# EAGLE design mux_capelet (EAGLE 6.5.0)
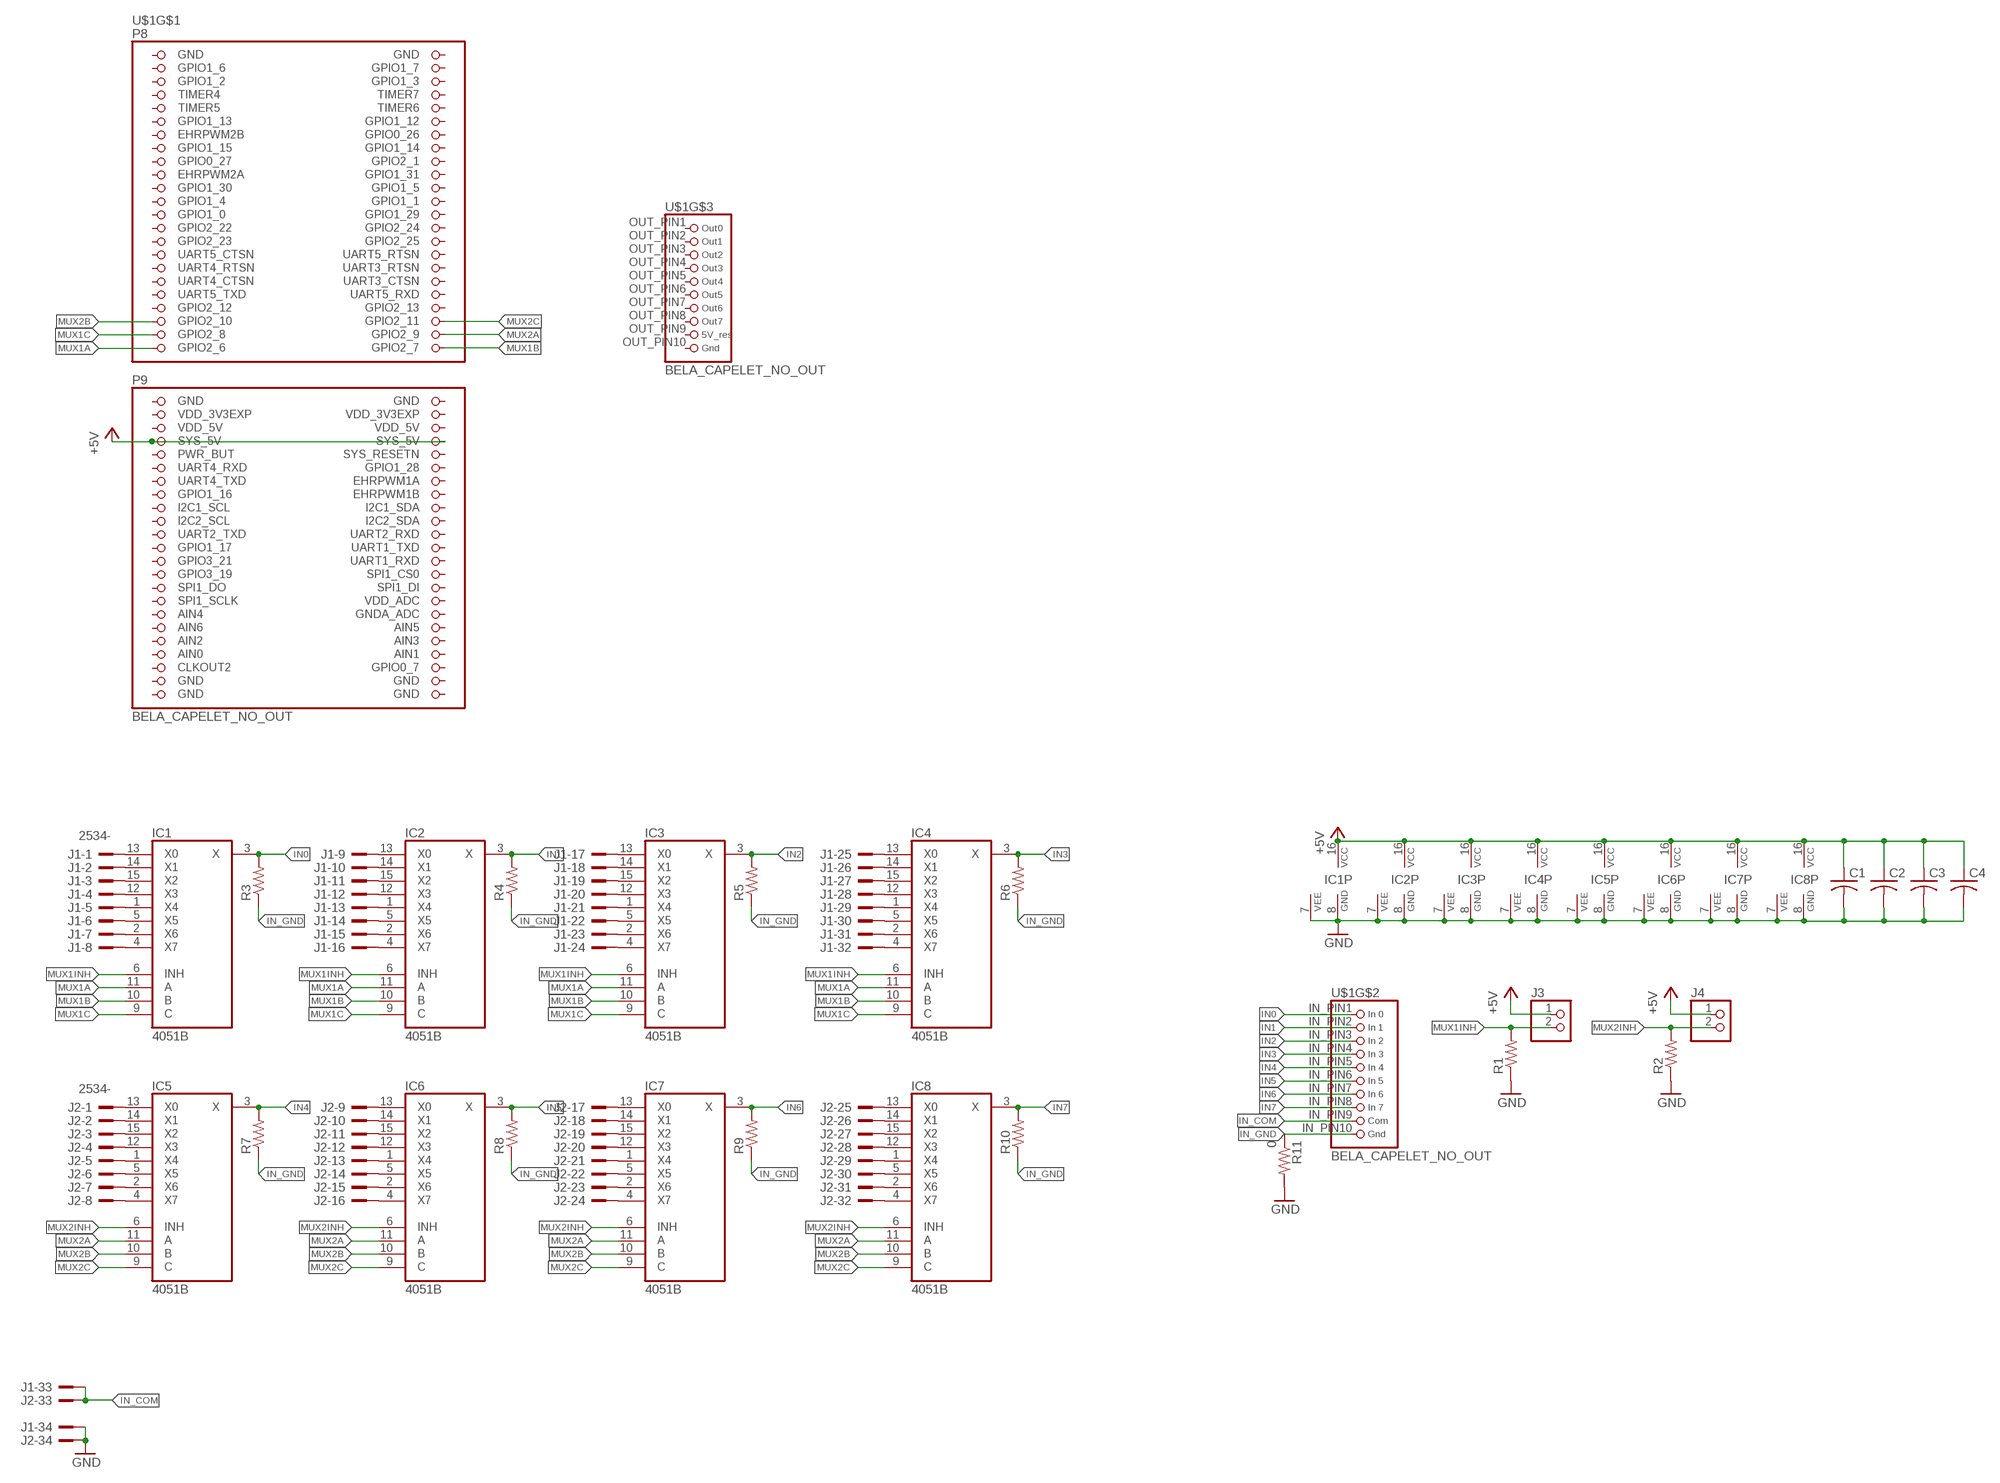
[diagram p0: schematic, sheet 1]

## Parts
C1  C-USC0603  [C0603]
C2  C-USC0603  [C0603]
C3  C-USC0603  [C0603]
C4  C-USC0603  [C0603]
IC1  4051B  [TSSOP16-PW]
IC2  4051B  [TSSOP16-PW]
IC3  4051B  [TSSOP16-PW]
IC4  4051B  [TSSOP16-PW]
IC5  4051B  [TSSOP16-PW]
IC6  4051B  [TSSOP16-PW]
IC7  4051B  [TSSOP16-PW]
IC8  4051B  [TSSOP16-PW]
J1  2534-  [PAK100/2500-34]
J2  2534-  [PAK100/2500-34]
J3  PINHD-1X2  [1X02]
J4  PINHD-1X2  [1X02]
R1  R-US_R0603  [R0603]
R2  R-US_R0603  [R0603]
R3  R-US_R0603  [R0603]
R4  R-US_R0603  [R0603]
R5  R-US_R0603  [R0603]
R6  R-US_R0603  [R0603]
R7  R-US_R0603  [R0603]
R8  R-US_R0603  [R0603]
R9  R-US_R0603  [R0603]
R10  R-US_R0603  [R0603]
R11  0  R-US_R0603  [R0603]
U$1  BELA_CAPELET_NO_OUT  [BELA_CAPELET_NO_OUTLINE]

## Nets
+5V: C1.1 C2.1 C3.1 C4.1 IC1.16(VCC) IC2.16(VCC) IC3.16(VCC) IC4.16(VCC) IC5.16(VCC) IC6.16(VCC) IC7.16(VCC) IC8.16(VCC) J3.1 J4.1 U$1.53(SYS_5V) U$1.54(SYS_5V)
GND: C1.2 C2.2 C3.2 C4.2 IC1.7(VEE) IC1.8(GND) IC2.7(VEE) IC2.8(GND) IC3.7(VEE) IC3.8(GND) IC4.7(VEE) IC4.8(GND) IC5.7(VEE) IC5.8(GND) IC6.7(VEE) IC6.8(GND) IC7.7(VEE) IC7.8(GND) IC8.7(VEE) IC8.8(GND) J1.34 J2.34 R1.1 R2.1 R11.2
IN0: IC1.3(X) R3.2 U$1.IN_PIN1
IN1: IC2.3(X) R4.2 U$1.IN_PIN2
IN2: IC3.3(X) R5.2 U$1.IN_PIN3
IN3: IC4.3(X) R6.2 U$1.IN_PIN4
IN4: IC5.3(X) R7.2 U$1.IN_PIN5
IN5: IC6.3(X) R8.2 U$1.IN_PIN6
IN6: IC7.3(X) R9.2 U$1.IN_PIN7
IN7: IC8.3(X) R10.2 U$1.IN_PIN8
IN_COM: J1.33 J2.33 U$1.IN_PIN9
IN_GND: R3.1 R4.1 R5.1 R6.1 R7.1 R8.1 R9.1 R10.1 R11.1 U$1.IN_PIN10
J2: IC7.15(X2) J2.19
MUX1A: IC1.11(A) IC2.11(A) IC3.11(A) IC4.11(A) U$1.45(GPIO2_6)
MUX1B: IC1.10(B) IC2.10(B) IC3.10(B) IC4.10(B) U$1.46(GPIO2_7)
MUX1C: IC1.9(C) IC2.9(C) IC3.9(C) IC4.9(C) U$1.43(GPIO2_8)
MUX1INH: IC1.6(INH) IC2.6(INH) IC3.6(INH) IC4.6(INH) J3.2 R1.2
MUX2A: IC5.11(A) IC6.11(A) IC7.11(A) IC8.11(A) U$1.44(GPIO2_9)
MUX2B: IC5.10(B) IC6.10(B) IC7.10(B) IC8.10(B) U$1.41(GPIO2_10)
MUX2C: IC5.9(C) IC6.9(C) IC7.9(C) IC8.9(C) U$1.42(GPIO2_11)
MUX2INH: IC5.6(INH) IC6.6(INH) IC7.6(INH) IC8.6(INH) J4.2 R2.2
N$1: IC6.13(X0) J2.9
N$2: IC6.14(X1) J2.10
N$3: IC6.15(X2) J2.11
N$4: IC6.12(X3) J2.12
N$5: IC6.1(X4) J2.13
N$6: IC6.5(X5) J2.14
N$7: IC6.2(X6) J2.15
N$8: IC6.4(X7) J2.16
N$9: IC5.13(X0) J2.1
N$10: IC5.14(X1) J2.2
N$11: IC5.15(X2) J2.3
N$12: IC5.12(X3) J2.4
N$13: IC5.1(X4) J2.5
N$14: IC5.5(X5) J2.6
N$15: IC5.2(X6) J2.7
N$16: IC5.4(X7) J2.8
N$17: IC7.13(X0) J2.17
N$18: IC7.14(X1) J2.18
N$20: IC7.12(X3) J2.20
N$21: IC7.1(X4) J2.21
N$22: IC7.5(X5) J2.22
N$23: IC7.2(X6) J2.23
N$24: IC7.4(X7) J2.24
N$25: IC8.13(X0) J2.25
N$26: IC8.14(X1) J2.26
N$27: IC8.15(X2) J2.27
N$28: IC8.12(X3) J2.28
N$29: IC8.1(X4) J2.29
N$30: IC8.5(X5) J2.30
N$31: IC8.2(X6) J2.31
N$32: IC8.4(X7) J2.32
N$33: IC1.13(X0) J1.1
N$34: IC1.14(X1) J1.2
N$35: IC1.15(X2) J1.3
N$36: IC1.12(X3) J1.4
N$37: IC1.1(X4) J1.5
N$38: IC1.5(X5) J1.6
N$39: IC1.2(X6) J1.7
N$40: IC1.4(X7) J1.8
N$41: IC2.13(X0) J1.9
N$42: IC2.14(X1) J1.10
N$43: IC2.15(X2) J1.11
N$44: IC2.12(X3) J1.12
N$45: IC2.1(X4) J1.13
N$46: IC2.5(X5) J1.14
N$47: IC2.2(X6) J1.15
N$48: IC2.4(X7) J1.16
N$49: IC3.13(X0) J1.17
N$50: IC3.14(X1) J1.18
N$51: IC3.15(X2) J1.19
N$52: IC3.12(X3) J1.20
N$53: IC3.1(X4) J1.21
N$54: IC3.5(X5) J1.22
N$55: IC3.2(X6) J1.23
N$56: IC3.4(X7) J1.24
N$57: IC4.13(X0) J1.25
N$58: IC4.14(X1) J1.26
N$59: IC4.15(X2) J1.27
N$60: IC4.12(X3) J1.28
N$61: IC4.1(X4) J1.29
N$62: IC4.5(X5) J1.30
N$63: IC4.2(X6) J1.31
N$64: IC4.4(X7) J1.32
Unconnected: U$1.3(GPIO1_6) U$1.4(GPIO1_7) U$1.5(GPIO1_2) U$1.6(GPIO1_3) U$1.7(TIMER4) U$1.8(TIMER7) U$1.9(TIMER5) U$1.10(TIMER6) U$1.11(GPIO1_13) U$1.12(GPIO1_12) U$1.13(EHRPWM2B) U$1.14(GPIO0_26) U$1.15(GPIO1_15) U$1.16(GPIO1_14) U$1.17(GPIO0_27) U$1.18(GPIO2_1) U$1.19(EHRPWM2A) U$1.20(GPIO1_31) U$1.21(GPIO1_30) U$1.22(GPIO1_5) U$1.23(GPIO1_4) U$1.24(GPIO1_1) U$1.25(GPIO1_0) U$1.26(GPIO1_29) U$1.27(GPIO2_22) U$1.28(GPIO2_24) U$1.29(GPIO2_23) U$1.30(GPIO2_25) U$1.31(UART5_CTSN) U$1.32(UART5_RTSN) U$1.33(UART4_RTSN) U$1.34(UART3_RTSN) U$1.35(UART4_CTSN) U$1.36(UART3_CTSN) U$1.37(UART5_TXD) U$1.38(UART5_RXD) U$1.39(GPIO2_12) U$1.40(GPIO2_13) U$1.55(PWR_BUT) U$1.56(SYS_RESETN) U$1.57(UART4_RXD) U$1.58(GPIO1_28) U$1.59(UART4_TXD) U$1.60(EHRPWM1A) U$1.61(GPIO1_16) U$1.62(EHRPWM1B) U$1.63(I2C1_SCL) U$1.64(I2C1_SDA) U$1.65(I2C2_SCL) U$1.66(I2C2_SDA) U$1.67(UART2_TXD) U$1.68(UART2_RXD) U$1.69(GPIO1_17) U$1.70(UART1_TXD) U$1.71(GPIO3_21) U$1.72(UART1_RXD) U$1.73(GPIO3_19) U$1.74(SPI1_CS0) U$1.75(SPI1_DO) U$1.76(SPI1_DI) U$1.77(SPI1_SCLK) U$1.78(VDD_ADC) U$1.79(AIN4) U$1.80(GNDA_ADC) U$1.81(AIN6) U$1.82(AIN5) U$1.83(AIN2) U$1.84(AIN3) U$1.86(AIN1) U$1.87(CLKOUT2) U$1.88(GPIO0_7) U$1.OUT_PIN1 U$1.OUT_PIN2 U$1.OUT_PIN3 U$1.OUT_PIN4 U$1.OUT_PIN5 U$1.OUT_PIN6 U$1.OUT_PIN7 U$1.OUT_PIN8 U$1.OUT_PIN9 U$1.OUT_PIN10

## Power pins joined to a net without a drawn wire
AIN0: U$1.85(AIN0)
GND: U$1.1(GND) U$1.2(GND) U$1.47(GND) U$1.48(GND) U$1.89(GND) U$1.90(GND) U$1.91(GND) U$1.92(GND)
VDD_3V3EXP: U$1.49(VDD_3V3EXP) U$1.50(VDD_3V3EXP)
VDD_5V: U$1.51(VDD_5V) U$1.52(VDD_5V)

## Library data of the parts
C1-C4 = resistor:C-US: CAPACITOR, American symbol
IC1-IC8 = custom:4051: 8-channel ANALOG MULTIPLEXER
J1 J2 = con-3m:2534-: 3M (TM) Pak 100 4-Wall Header Source: 3M; OC_FARNELL: unknown; OC_NEWARK: unknown
J3 J4 = pinhead:PINHD-1X2: PIN HEADER
R1-R11 = rcl:R-US_: RESISTOR, American symbol
U$1 = custom:BELA_CAPELET: Should match A3 pinout - but not completely tested

## Board
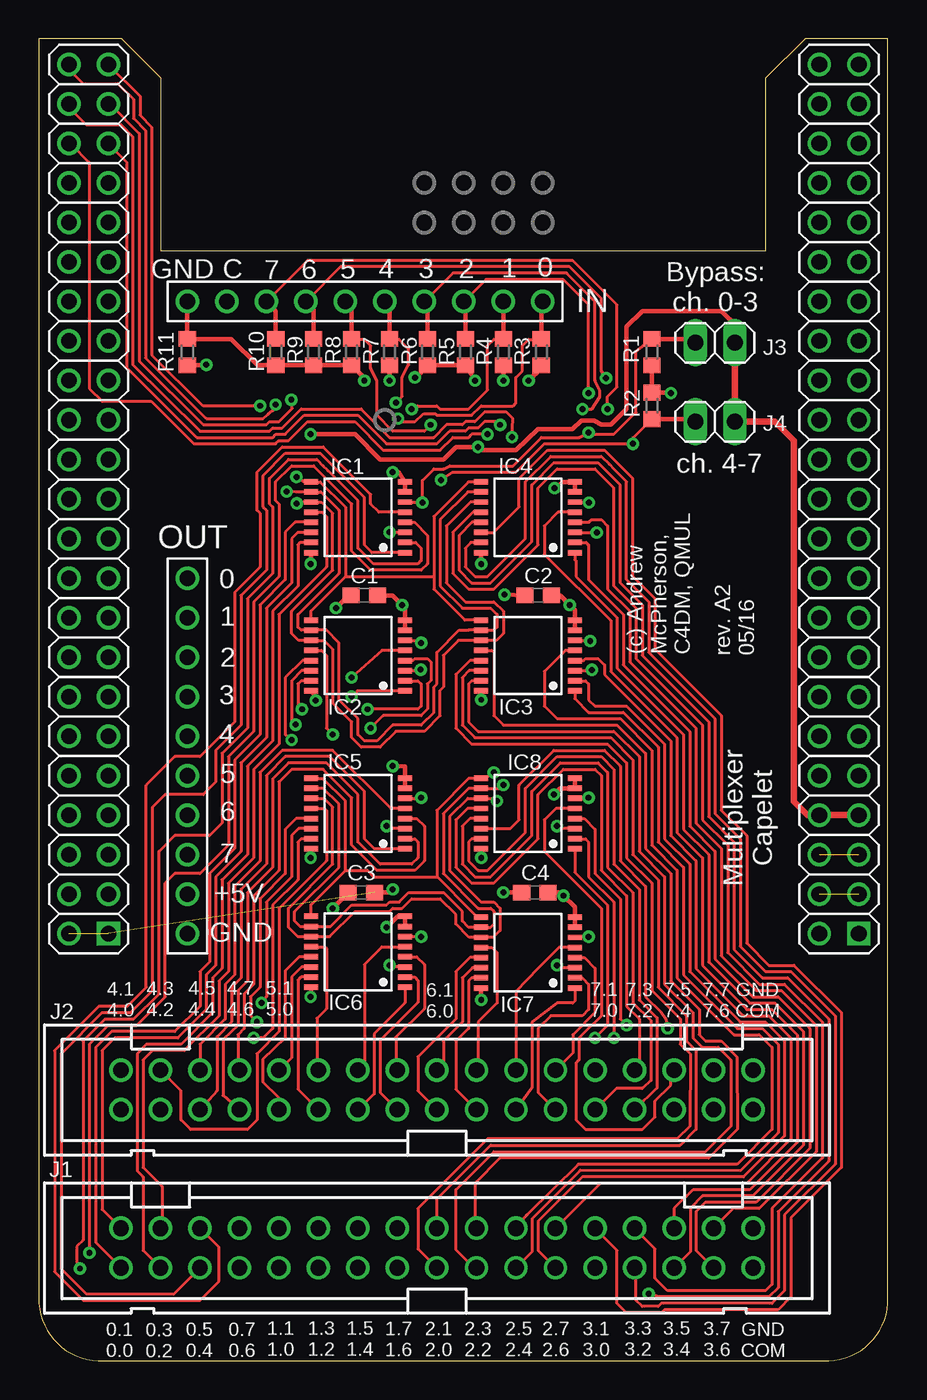
[diagram p1: board, top side]
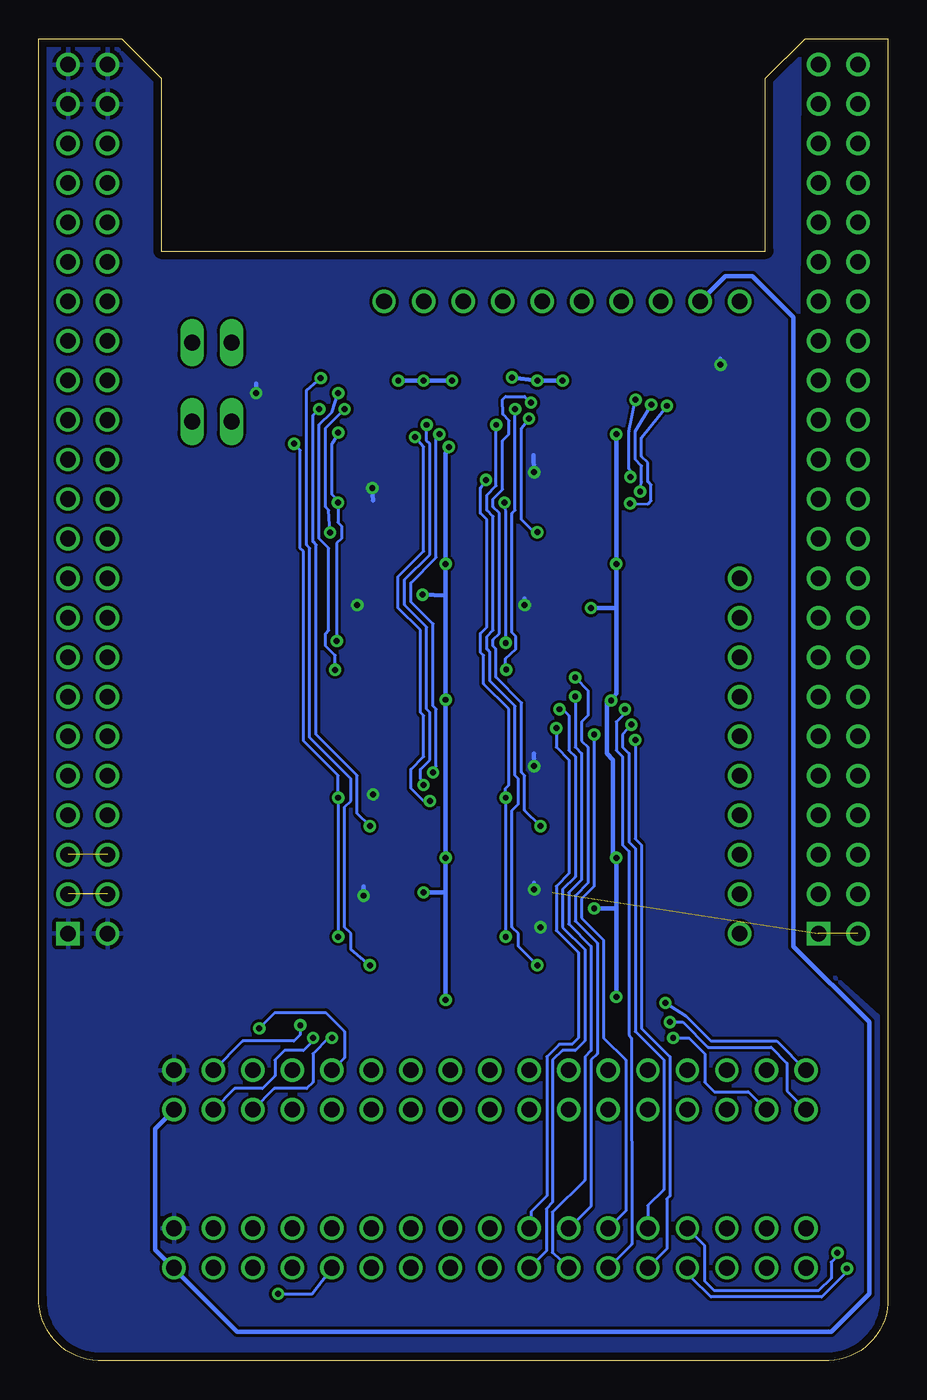
[diagram p2: board, bottom side, seen from below]

Size 54.61 x 84.99 mm. Coordinates in mm from the lower left corner, seen from the top.
Outline: 0,84.99 0,4.04 arc90 3.81,0 50.8,0 arc90 54.61,4.04 54.61,84.99 49.28,84.99 46.74,82.45 46.74,71.35 7.87,71.35 7.87,82.45 5.33,84.99 0,84.99
Copper layers (1*16): Top 0.035mm / dielectric 1.5mm / Bottom 0.035mm
Design rules "default *": minimum track width 7mil, minimum drill 15mil, track to track 7mil, track to pad 7mil, pad to pad 7mil, via to via 7mil, smd to smd 0mil, copper to edge 20mil, drill to drill 8mil, minimum pad ring 10mil, minimum via ring 8mil, stop-mask expansion 4mil, vias tented up to drill 20mil, thermal gap 10mil

### Footprints (pad centres in the part's own frame; a part is rotated, then mirrored left to right if it is on the bottom)
C0603 = smd 1.1 x 1: 1 -0.85,0; 2 0.85,0
TSSOP16-PW = smd 0.35 x 0.9: 1 -2.275,-3.025; 2 -1.625,-3.025; 3 -0.975,-3.025; 4 -0.325,-3.025; 5 0.325,-3.025; 6 0.975,-3.025; 7 1.625,-3.025; 8 2.275,-3.025; 9 2.275,3.025; 10 1.625,3.025; 11 0.975,3.025; 12 0.325,3.025; 13 -0.325,3.025; 14 -0.975,3.025; 15 -1.625,3.025; 16 -2.275,3.025
PAK100/2500-34 = drill 1 pad 1.422: 1 -20.32,-1.27; 2 -20.32,1.27; 3 -17.78,-1.27; 4 -17.78,1.27; 5 -15.24,-1.27; 6 -15.24,1.27; 7 -12.7,-1.27; 8 -12.7,1.27; 9 -10.16,-1.27; 10 -10.16,1.27; 11 -7.62,-1.27; 12 -7.62,1.27; 13 -5.08,-1.27; 14 -5.08,1.27; 15 -2.54,-1.27; 16 -2.54,1.27; 17 0,-1.27; 18 0,1.27; 19 2.54,-1.27; 20 2.54,1.27; 21 5.08,-1.27; 22 5.08,1.27; 23 7.62,-1.27; 24 7.62,1.27; 25 10.16,-1.27; 26 10.16,1.27; 27 12.7,-1.27; 28 12.7,1.27; 29 15.24,-1.27; 30 15.24,1.27; 31 17.78,-1.27; 32 17.78,1.27; 33 20.32,-1.27; 34 20.32,1.27
1X02 = drill 1.016 long: 1 -1.27,0; 2 1.27,0
R0603 = smd 1 x 1.1: 1 -0.85,0; 2 0.85,0
BELA_CAPELET_NO_OUTLINE = drill 1 square: 1 -20.32,-31.75; 47 27.94,-31.75 | drill 1: 2 -22.86,-31.75; 3 -20.32,-29.21; 4 -22.86,-29.21; 5 -20.32,-26.67; 6 -22.86,-26.67; 7 -20.32,-24.13; 8 -22.86,-24.13; 9 -20.32,-21.59; 10 -22.86,-21.59; 11 -20.32,-19.05; 12 -22.86,-19.05; 13 -20.32,-16.51; 14 -22.86,-16.51; 15 -20.32,-13.97; 16 -22.86,-13.97; 17 -20.32,-11.43; 18 -22.86,-11.43; 19 -20.32,-8.89; 20 -22.86,-8.89; 21 -20.32,-6.35; 22 -22.86,-6.35; 23 -20.32,-3.81; 24 -22.86,-3.81; 25 -20.32,-1.27; 26 -22.86,-1.27; 27 -20.32,1.27; 28 -22.86,1.27; 29 -20.32,3.81; 30 -22.86,3.81; 31 -20.32,6.35; 32 -22.86,6.35; 33 -20.32,8.89; 34 -22.86,8.89; 35 -20.32,11.43; 36 -22.86,11.43; 37 -20.32,13.97; 38 -22.86,13.97; 39 -20.32,16.51; 40 -22.86,16.51; 41 -20.32,19.05; 42 -22.86,19.05; 43 -20.32,21.59; 44 -22.86,21.59; 45 -20.32,24.13; 46 -22.86,24.13; 48 25.4,-31.75; 49 27.94,-29.21; 50 25.4,-29.21; 51 27.94,-26.67; 52 25.4,-26.67; 53 27.94,-24.13; 54 25.4,-24.13; 55 27.94,-21.59; 56 25.4,-21.59; 57 27.94,-19.05; 58 25.4,-19.05; 59 27.94,-16.51; 60 25.4,-16.51; 61 27.94,-13.97; 62 25.4,-13.97; 63 27.94,-11.43; 64 25.4,-11.43; 65 27.94,-8.89; 66 25.4,-8.89; 67 27.94,-6.35; 68 25.4,-6.35; 69 27.94,-3.81; 70 25.4,-3.81; 71 27.94,-1.27; 72 25.4,-1.27; 73 27.94,1.27; 74 25.4,1.27; 75 27.94,3.81; 76 25.4,3.81; 77 27.94,6.35; 78 25.4,6.35; 79 27.94,8.89; 80 25.4,8.89; 81 27.94,11.43; 82 25.4,11.43; 83 27.94,13.97; 84 25.4,13.97; 85 27.94,16.51; 86 25.4,16.51; 87 27.94,19.05; 88 25.4,19.05; 89 27.94,21.59; 90 25.4,21.59; 91 27.94,24.13; 92 25.4,24.13; IN_PIN1 7.62,8.89; IN_PIN2 5.08,8.89; IN_PIN3 2.54,8.89; IN_PIN4 0,8.89; IN_PIN5 -2.54,8.89; IN_PIN6 -5.08,8.89; IN_PIN7 -7.62,8.89; IN_PIN8 -10.16,8.89; IN_PIN9 -12.7,8.89; IN_PIN10 -15.24,8.89; OUT_PIN1 -15.24,-8.89; OUT_PIN2 -15.24,-11.43; OUT_PIN3 -15.24,-13.97; OUT_PIN4 -15.24,-16.51; OUT_PIN5 -15.24,-19.05; OUT_PIN6 -15.24,-21.59; OUT_PIN7 -15.24,-24.13; OUT_PIN8 -15.24,-26.67; OUT_PIN9 -15.24,-29.21; OUT_PIN10 -15.24,-31.75

### Placement (x,y rotation side)
C1  20.93,49.2 0 top
C2  32.11,49.2 0 top
C3  20.73,30.1 0 top
C4  31.9,30.1 0 top
IC1  20.52,54.23 90 top
IC2  20.52,45.34 90 top
IC3  31.45,45.34 90 top
IC4  31.45,54.23 90 top
IC5  20.52,35.18 90 top
IC6  20.52,26.29 90 top
IC7  31.45,26.24 90 top
IC8  31.45,35.18 90 top
J1  25.6,7.24 0 top
J2  25.6,17.4 0 top
J3  43.48,65.46 180 top
J4  43.48,60.38 180 top
R1  39.42,64.85 90 top
R2  39.42,61.39 270 top
R3  32.31,64.85 90 top
R4  29.87,64.85 90 top
R5  27.43,64.85 90 top
R6  24.99,64.85 90 top
R7  22.56,64.85 90 top
R8  20.12,64.85 90 top
R9  17.68,64.85 90 top
R10  15.24,64.85 90 top
R11  9.55,64.85 270 top
U$1  24.79,59.21 0 top

### Tracks (layer width: path | path; a pad name or v marks a point on that pad's centre or on a via)
+5V  (via drill 0.38)
  Top 0.305: IC6.16 17.5,23.42 v17.48,23.39 | v17.48,32.33 17.48,32.88 IC5.16 | IC8.16 28.42,32.36 v28.45,32.33 | v28.45,23.19 28.45,23.73 IC7.16 | C4.1 v29.87,30.1 | C3.1 19.88,30.06 v18.9,29.08 | IC3.16 28.42,42.52 v28.45,42.49 | IC2.16 17.91,42.52 v17.8,42.44 | IC1.16 17.5,51.25 v17.48,51.23 | IC4.16 28.42,51.26 v28.45,51.23 | C1.1 19.91,49.2 v19.1,48.39 | C2.1 v29.94,49.25 | J3.1 44.91,65.61 44.91,66.47 43.89,67.49 38.81,67.49 37.8,66.47 37.8,61.19 36.78,60.17 36.17,60.17 35.71,60.45 34.9,60.45 34.33,59.88 32.09,59.88 30.68,58.55 28.45,58.55 v28.25,58.75 26.82,58.75 26.01,57.94 21.95,57.94 20.32,59.56 v17.48,59.56
  Top 0.406: J3.1 J4.1 47.35,60.38 48.56,59.16 48.56,35.94 48.87,35.64 49.17,35.33 49.43,35.08 U$1.54 U$1.53
  Bottom 0.305: v17.48,23.39 17.48,29.08 | 17.48,29.08 v17.48,32.33 17.68,32.54 17.68,38.63 18.09,39.04 18.09,42.29 v17.8,42.44 17.48,42.9 17.48,48.39 | 28.45,30.1 v28.45,32.33 v28.45,42.49 28.45,49.2 | 28.45,30.1 v28.45,23.19 | v29.87,30.1 28.45,30.1 | v18.9,29.08 17.48,29.08 | 17.48,48.39 v17.48,51.23 v17.48,59.56 | 28.45,49.2 v28.45,51.23 28.45,58.34 28.25,58.55 v28.25,58.75 | v19.1,48.39 17.48,48.39 | v29.94,49.25 28.45,49.2
GND  (via drill 0.38)  (2 unrouted)
  Top 0.305: IC6.7 IC6.8 23.05,28.56 v22.35,27.86 | IC5.8 IC5.7 23.55,38.2 v22.76,38.23 | IC8.8 IC8.7 33.53,36.8 v33.12,36.4 | IC7.7 IC7.8 34.47,29.16 v33.73,29.9 33.53,30.1 C4.2 | C3.2 22.76,30.1 v22.76,30.3 | IC2.7 IC2.8 23.55,48.41 v23.37,48.59 22.76,49.2 C1.2 | IC3.7 IC3.8 34.47,48.26 v34.14,48.59 33.53,49.2 C2.2 | IC4.7 IC4.8 33.72,56.5 v33.17,56.11 | IC1.7 IC1.8 23.15,57.11 v22.76,57.12 | R1.1 R2.1 40.47,62.24 v40.64,62.2 | R11.2 10.73,64 v10.77,64.03
  Bottom 0.305: v33.73,29.9 33.73,30.51 | v22.76,30.3 22.76,30.71 | v23.37,48.59 23.37,49 | v33.17,56.11 33.12,55.3 | v22.76,57.12 22.81,58.22 | v34.14,48.59 34.14,48.79 | v22.35,27.86 22.35,27.66 | v22.76,38.23 22.76,39.04 | v33.12,36.4 33.12,36.19 | v40.64,62.2 40.64,62.81 | v10.77,64.03 10.77,64.44
  pour Bottom: 0,0.23 54.55,0.23 54.55,85.09 5.69,84.89 5.89,26.85 0,21.56
IN0  (via drill 0.38)
  Top 0.178: IC1.3 22.36,53.25 v22.55,53.26 | v23.09,60.58 23.3,60.38 24.18,60.38 24.75,60.89 25.5,60.89 25.6,60.78 27.84,60.78 28.45,61.39 30.48,61.39 30.68,61.59 30.68,63.22 31.09,63.63 31.09,65.25 31.5,65.66 32.27,65.66 R3.2
  Top 0.305: R3.2 32.31,68 U$1.IN_PIN1
  Bottom 0.178: v22.55,53.26 22.76,53.26 23.57,54.08 23.57,59.97 v23.09,60.58
IN1  (via drill 0.38)
  Top 0.178: IC2.3 24.43,44.36 v24.55,44.43 | v23.98,61.19 24.18,61.19 24.38,61.39 25.6,61.39 25.81,61.19 27.64,61.19 28.85,62.41 28.85,65.25 29.26,65.66 29.83,65.66 R4.2
  Top 0.305: R4.2 U$1.IN_PIN2
  Bottom 0.178: v24.55,44.43 24.59,45.14 23.93,45.75 23.93,46.56 24.18,46.81 24.18,54.48 23.98,54.69 v23.98,61.19
IN2  (via drill 0.38)
  Top 0.178: IC3.3 35.4,44.36 v35.56,44.42 | v35.36,62.2 35.36,67.89 33.73,69.52 28.75,69.52 U$1.IN_PIN3
  Top 0.305: R5.2 27.43,68 U$1.IN_PIN3
  Bottom 0.178: v35.56,44.42 35.56,45.34 36.17,45.95 36.17,46.76 35.97,46.96 35.97,52.25 36.58,52.86 36.58,60.17 35.76,60.99 v35.36,62.2
IN3  (via drill 0.38)
  Top 0.178: IC4.3 35.96,53.25 v35.88,53.25 | v34.95,61.19 35.56,61.19 36.07,61.97 36.07,62.38 35.76,63.02 35.76,68.1 33.93,69.93 26.62,69.93 U$1.IN_PIN4
  Top 0.305: R6.2 24.99,67.89 U$1.IN_PIN4
  Bottom 0.178: v35.88,53.25 35.97,54.69 36.17,54.89 36.17,59.97 v34.95,61.19
IN4  (via drill 0.38)
  Top 0.178: IC5.3 22.51,34.2 v22.35,34.37 | v22.96,61.59 23.37,62 23.37,63.22 23.77,64.03 23.77,65.05 23.16,65.66 22.59,65.66 R7.2
  Top 0.305: R7.2 22.55,67.79 U$1.IN_PIN5
  Bottom 0.178: v22.35,34.37 23.37,35.38 23.37,37.62 23.57,37.82 23.57,42.29 25.22,43.94 25.22,45.77 25.4,45.95 25.4,46.35 24.99,46.76 24.99,54.48 25.4,54.89 25.4,55.41 24.79,56.02 24.79,59.16 24.38,59.56 24.36,60.44 24.77,60.85 24.79,61.8 24.59,62 23.37,62 v22.96,61.59
IN5  (via drill 0.38)
  Top 0.178: IC6.3 22.67,25.31 v22.55,25.43 | v25.2,60.17 24.79,59.77 22.76,59.77 21.74,60.78 21.74,63.02 21.34,63.83 21.34,65.25 20.93,65.66 20.15,65.66 R8.2
  Top 0.305: R8.2 20.12,67.69 U$1.IN_PIN6
  Bottom 0.178: v22.55,25.43 23.77,26.64 23.77,27.46 24.18,27.86 24.18,35.38 23.77,35.79 23.77,37.41 23.98,37.62 23.98,42.09 25.6,43.71 25.6,45.54 25.81,45.75 25.81,46.56 25.4,46.96 25.4,54.28 25.81,54.69 25.81,55.65 25.2,56.26 v25.2,60.17
IN6  (via drill 0.38)
  Top 0.178: IC7.3 33.49,25.26 v33.33,25.43 | v36.48,63.17 36.17,63.63 36.17,68.3 34.14,70.33 19.41,70.33 U$1.IN_PIN7
  Top 0.305: R9.2 17.68,67.59 U$1.IN_PIN7
  Bottom 0.178: v33.33,25.43 34.54,26.44 34.54,27.46 34.95,27.86 34.95,35.59 34.54,35.99 34.54,37.41 37.19,40.06 37.19,52.25 37.39,52.45 37.39,62.41 v36.48,63.17
IN7  (via drill 0.38)
  Top 0.178: IC8.3 33.49,34.2 v33.33,34.37 | v36.58,61.19 36.58,62 37.19,62.61 37.19,67.89 34.34,70.74 17.27,70.74 U$1.IN_PIN8
  Top 0.305: R10.2 15.24,67.49 U$1.IN_PIN8
  Bottom 0.178: v33.33,34.37 34.14,35.18 34.14,37.62 36.78,40.26 36.78,52.45 36.98,52.65 36.98,60.78 v36.58,61.19
IN_COM
  Bottom 0.305: J2.33 47.14,14.91 47.14,7.14 45.97,5.97 J1.33 45.92,5.92 41.86,1.85 3.66,1.85 1.22,4.29 1.22,21.77 6.1,26.64 6.1,67.08 8.74,69.72 10.46,69.72 U$1.IN_PIN9
IN_GND  (via drill 0.38)
  Top 0.305: U$1.IN_PIN10 R11.1 12.36,65.7 14.06,64 R10.1 R9.1 R8.1 21.1,63.02 v20.93,63.02 | R7.1 v22.55,63.02 | v24.18,63.22 24.99,63.83 R6.1 R5.1 v28.04,63.02 | v29.87,63.02 R4.1 | R3.1 32.31,63.83 v31.5,63.02
  Bottom 0.305: v20.93,63.02 v22.55,63.02 v24.18,63.22 | v28.04,63.02 v29.87,63.02 v31.5,63.02
J2
  Top 0.178: IC7.15 27.84,24.61 27.64,24.41 27.64,21.36 26.82,20.55 26.82,17.45 J2.19
MUX1A  (via drill 0.38)
  Top 0.178: IC4.11 27.75,55.2 26.21,53.67 26.21,50.01 27.43,48.79 29.26,48.79 29.87,48.18 29.87,46.76 29.42,46.31 IC3.11 26.98,46.31 26.01,45.34 26.01,43.31 25.81,43.1 25.81,41.48 24.79,40.46 22.96,40.46 21.95,39.45 20.73,39.45 20.12,40.06 20.12,41.07 18.9,42.29 18.9,45.75 18.33,46.31 IC2.11 16.7,46.31 16.26,46.76 16.26,48.18 18.9,50.83 18.9,54.48 18.18,55.2 IC1.11 16.77,55.2 v16.59,55.12 | U$1.45 6.5,81.31 6.5,80.09 7.26,79.3 7.26,64.67 10.57,61.39 v14.22,61.39
  Bottom 0.178: v16.59,55.12 15.44,55.09 15.24,55.3 15.24,56.31 15.44,56.51 15.44,57.73 15.85,58.14 15.85,59.36 v14.22,61.39
MUX1B  (via drill 0.38)
  Top 0.178: IC4.10 27.58,55.85 25.81,54.08 25.81,49.81 27.23,48.39 29.06,48.39 29.46,47.98 29.46,47.17 29.26,46.96 IC3.10 27.64,46.96 27.63,46.96 27.03,46.96 25.6,45.54 25.6,43.51 25.4,43.31 25.4,41.68 24.59,40.87 22.76,40.87 21.74,39.85 20.93,39.85 20.52,40.26 20.52,41.27 19.3,42.49 19.3,46.15 18.49,46.96 IC2.10 16.87,46.96 16.66,47.17 16.66,47.98 19.3,50.62 19.3,54.69 18.14,55.85 IC1.10 16.51,55.85 v15.94,55.89 | U$1.46 1.93,83.03 2.85,82.12 5.08,82.12 6.1,81.1 6.1,79.88 6.86,79.1 6.86,64.47 10.77,60.58 14.43,60.58 14.75,60.85 15.04,61.08 v15.23,61.48
  Bottom 0.178: v15.94,55.89 15.85,56.51 15.85,57.53 16.26,57.94 16.26,59.77 v15.23,61.48
MUX1C  (via drill 0.38)
  Top 0.178: IC2.9 17.5,48.21 19.71,50.42 | IC4.9 27.62,56.5 25.4,54.28 25.4,50.42 | 25.4,50.42 25.4,49.61 27.39,47.61 IC3.9 | 19.71,50.42 25.4,50.42 | 19.71,50.42 19.71,54.89 18.1,56.5 IC1.9 17.08,56.5 v16.56,56.82 | U$1.43 4.57,80.8 6.45,78.89 6.45,64.26 10.57,60.17 14.63,60.17 14.83,60.38 15.44,60.38 16.26,61.19 16.29,61.22 v16.24,61.78
  Bottom 0.178: v16.56,56.82 16.56,57.23 16.66,57.33 16.66,59.77 v16.24,61.78
MUX1INH  (via drill 0.38)
  Top 0.178: IC4.6 35.35,55.2 v35.38,55.18 | 35.36,46.35 v35.45,46.26 35.2,46.31 IC3.6 | IC1.6 24.48,55.2 v24.66,55.17 24.66,56.59 25.4,57.33 26.01,57.33 26.42,57.53 30.48,57.53 32.31,59.36 34.75,59.36 v35.36,59.66 35.56,59.56 36.98,59.56 38.41,60.99 38.41,64.88 R1.2 | IC2.6 24.43,46.31 v24.59,46.15
  Top 0.305: R1.2 41.97,65.7 J3.2
  Bottom 0.178: v35.45,46.26 35.45,52.56 35.15,52.86 35.15,53.67 35.38,53.9 v35.38,55.18 35.38,55.32 35.76,55.7 35.76,58.95 35.36,59.56 v35.36,59.66 | v24.66,55.17 24.59,54.53 v24.59,46.15
MUX2A  (via drill 0.38)
  Top 0.178: IC5.11 18.33,36.15 18.9,35.59 18.9,31.93 16.05,29.08 16.05,27.86 16.65,27.26 IC6.11 18.7,27.26 20.32,28.88 22.55,28.88 22.76,29.08 23.37,29.08 23.98,29.69 25.81,29.69 26.82,28.68 26.82,28.07 27.68,27.21 IC7.11 29.22,27.21 29.67,27.66 29.67,29.08 29.26,29.49 28.45,29.49 26.42,31.52 26.42,34.98 27.59,36.15 IC8.11 29.22,36.15 v29.46,35.99 | U$1.44 1.93,80.59 3.05,79.48 5.28,79.48 6.04,78.69 6.04,64.06 10.36,59.77 14.83,59.77 15.04,59.97 15.65,59.97 16.87,61.19 20.73,61.19 22.55,59.36 25.4,59.36 26.21,60.17 27.23,60.17 27.43,60.38 28.04,60.38 28.65,60.99 30.07,60.99 30.48,60.58 v30.42,59.38
  Bottom 0.178: v29.46,35.99 29.87,35.99 30.68,36.8 30.68,38.02 29.87,38.84 29.87,41.48 30.07,41.68 30.07,46.96 31.5,48.39 31.5,50.42 29.87,52.04 29.87,58.75 v30.42,59.38
MUX2B  (via drill 0.38)
  Top 0.178: IC5.10 18.29,36.8 19.3,35.79 19.3,31.72 16.46,28.88 16.46,28.27 16.82,27.91 IC6.10 18.75,27.91 20.12,29.29 22.35,29.29 22.55,29.49 23.16,29.49 23.77,30.1 26.01,30.1 27.23,28.88 27.23,28.27 27.64,27.86 IC7.10 29.06,27.86 29.26,28.07 29.26,28.88 29.06,29.08 28.25,29.08 26.01,31.32 26.01,35.18 27.64,36.8 IC8.10 29.67,36.8 v29.87,37.01 | U$1.41 5.64,77.06 5.64,63.86 10.16,59.36 15.04,59.36 15.24,59.56 15.85,59.56 17.07,60.78 20.52,60.78 22.35,58.95 25.6,58.95 26.42,59.77 27.43,59.77 27.64,59.97 28.25,59.97 28.65,60.38 29.46,60.38 v29.67,60.17
  Bottom 0.178: v29.87,37.01 29.87,37.21 30.07,37.41 30.07,38.02 29.46,38.63 29.46,41.68 29.67,41.88 29.67,47.17 31.09,48.59 31.09,50.22 29.46,51.84 29.46,58.95 29.67,59.16 v29.67,60.17
MUX2C  (via drill 0.38)
  Top 0.178: IC6.9 17.5,29.31 19.71,31.52 | 19.71,31.52 19.71,35.99 18.29,37.41 17.54,37.41 IC5.9 | 25.6,31.13 25.6,35.38 27.68,37.45 IC8.9 28.69,37.45 v29.26,37.82 | 25.6,31.13 27.84,28.88 28.2,28.51 IC7.9 | 19.71,31.52 21.13,31.52 21.54,31.11 25.59,31.11 25.6,31.13 | U$1.42 2.03,78.26 3.25,77.04 3.25,62.51 4.06,61.7 7.21,61.7 9.96,58.95 15.24,58.95 15.44,59.16 16.05,59.16 17.27,60.38 20.32,60.38 22.15,58.55 25.81,58.55 26.62,59.36 27.64,59.36 27.84,59.56 v28.85,59.56
  Bottom 0.178: v29.26,37.82 29.26,38.02 29.06,38.23 29.06,41.88 29.26,42.09 29.26,47.37 30.68,48.79 30.68,50.01 29.06,51.64 29.06,59.36 v28.85,59.56
MUX2INH  (via drill 0.38)
  Top 0.178: IC8.6 35.32,36.15 v35.36,36.19 | v35.36,27.25 34.51,27.25 IC7.6 | IC5.6 24.55,36.15 v24.59,36.19 | v24.59,27.25 23.56,27.25 IC6.6 | v25.86,56.63 26.62,57.12 30.68,57.12 32.51,58.95 v38.2,58.95 38.2,59.32 R2.2
  Top 0.305: R2.2 42.05,60.54 J4.2
  Bottom 0.178: v35.36,27.25 v35.36,36.19 35.36,37.62 37.59,39.85 37.59,52.04 37.8,52.25 37.8,58.55 v38.2,58.95 | v24.59,27.25 v24.59,36.19 24.59,36.8 24.38,37.01 24.38,41.88 26.01,43.51 26.01,45.34 26.21,45.54 26.21,46.76 25.81,47.17 25.81,54.08 26.21,54.48 26.21,56.11 v25.86,56.63
N$1
  Top 0.178: IC6.13 16.74,25.96 15.85,25.07 15.85,20.75 14.4,19.35 14.4,17.93 15.44,16.89 J2.9
N$2
  Top 0.178: IC6.14 16.91,25.31 16.26,24.66 16.26,19.48 J2.10
N$3
  Top 0.178: IC6.15 16.87,24.66 16.66,24.46 16.66,17.45 J2.11
N$4
  Top 0.178: IC6.12 18.37,26.61 18.49,26.49 18.49,22.63 17.88,22.02 17.88,18.77 J2.12
N$5
  Top 0.178: IC6.1 23.55,23.01 21.57,21.01 21.57,17.14 J2.13
N$6
  Top 0.178: J2.14 20.93,19.08 20.93,25.48 22.07,26.61 IC6.5
N$7
  Top 0.178: IC6.2 24.18,24.66 24.38,24.46 24.38,23.04 21.95,20.6 21.95,17.25 J2.15
N$8
  Top 0.178: IC6.4 24.3,25.96 24.79,25.48 24.79,22.63 22.96,20.8 22.96,18.77 J2.16
N$9  (via drill 0.38)
  Top 0.178: IC5.13 16.54,34.85 15.85,34.16 15.85,31.32 14.22,29.69 14.22,24 13.61,23.39 13.61,22.17 v14.02,21.77
  Bottom 0.178: v14.02,21.77 13.21,21.77 11.58,20.14 7.52,20.14 6.5,19.13 6.5,17.35 J2.1
N$10  (via drill 0.38)
  Top 0.178: IC5.14 16.7,34.2 16.26,33.76 16.26,31.11 14.63,29.49 14.63,23.39 v14.32,23
  Bottom 0.178: v14.32,23 13.01,22.17 11.38,20.55 7.16,20.55 J2.2
N$11  (via drill 0.38)
  Top 0.178: IC5.15 16.87,33.55 16.66,33.35 16.66,30.91 15.04,29.29 15.04,21.36 14.43,20.75 v13.82,20.75
  Bottom 0.178: v13.82,20.75 12.8,20.75 11.79,19.74 11.79,17.91 11.18,17.3 8.99,17.3 J2.3
N$12
  Top 0.178: IC5.12 18.37,35.5 18.49,35.38 18.49,32.13 15.44,29.08 15.44,21.16 14.02,19.74 14.02,15.47 13.41,14.86 9.75,14.86 9.14,15.47 9.14,17.35 J2.4
N$13
  Top 0.178: IC5.1 21.58,32.9 20.93,33.55 20.93,36.6 18.69,38.84 15.85,38.84 14.63,37.62 14.63,31.93 13.01,30.3 13.01,24.61 12.39,24 12.39,21.77 11.46,20.83 11.46,17.35 J2.5
N$14
  Top 0.178: IC5.5 22.64,35.5 18.9,39.24 15.65,39.24 14.22,37.82 14.22,32.13 12.6,30.51 12.6,24.82 11.99,24.21 11.99,21.97 10.36,20.35 J2.6
N$15
  Top 0.178: IC5.2 24.18,33.55 24.38,33.35 24.38,32.33 23.98,31.93 21.95,31.93 20.52,33.35 20.52,36.4 18.49,38.43 16.05,38.43 15.04,37.41 15.04,31.72 13.41,30.1 13.41,24.41 12.8,23.8 12.8,21.56 11.84,20.65 11.84,17.04 J2.7
N$16
  Top 0.178: IC5.4 24.3,34.85 24.79,34.37 24.79,32.13 24.18,31.52 21.74,31.52 20.12,33.15 20.12,36.19 18.29,38.02 16.26,38.02 15.44,37.21 15.44,31.52 13.82,29.9 13.82,24.21 13.21,23.6 13.21,21.36 12.8,20.95 12.8,18.77 J2.8
N$17
  Top 0.178: IC7.13 27.72,25.91 26.82,25.02 26.82,21.97 24.38,19.53 24.38,17.35 J2.17
N$18
  Top 0.178: IC7.14 27.88,25.26 27.23,24.61 27.23,21.77 26.01,20.55 26.01,19.08 J2.18
N$20
  Top 0.178: IC7.12 29.14,26.56 29.46,26.24 29.46,22.99 28.25,21.77 28.25,18.77 J2.20
N$21
  Top 0.178: IC7.1 34.47,23.12 34.34,22.99 33.33,22.99 31.73,21.77 31.73,17.55 J2.21
N$22
  Top 0.178: IC7.5 33.45,26.56 32.11,25.22 30.68,23.75 J2.22
N$23
  Top 0.178: IC7.2 34.95,24.61 35.36,24.21 35.36,22.58 34.95,22.17 32.92,22.17 32.11,21.36 32.11,17.25 J2.23
N$24
  Top 0.178: IC7.4 35.07,25.91 35.76,25.22 35.76,22.38 34.34,20.95 34.34,19.79 J2.24
N$25
  Top 0.178: IC8.13 27.72,34.85 27.23,34.37 27.23,31.93 28.04,31.11 29.06,31.11 31.7,33.76 31.7,36.6 33.53,38.43 35.97,38.43 36.58,37.82 36.58,31.72 38.2,30.1 38.2,22.99 39.37,21.87 39.37,18.01 38.81,17.5 37.13,17.5 J2.25
N$26  (via drill 0.38)
  Top 0.178: IC8.14 30.32,34.2 30.89,34.77 30.89,37.01 33.12,39.24 36.37,39.24 37.39,38.23 37.39,32.13 39.01,30.51 39.01,23.39 40.03,22.38 40.34,21.97 v40.44,21.36
  Bottom 0.178: v40.44,21.36 39.42,22.38 36.17,22.38 34.95,21.16 34.95,19.48 J2.26
N$27
  Top 0.178: IC8.15 27.84,33.55 27.64,33.35 27.64,32.13 28.25,31.52 28.85,31.52 31.29,33.96 31.29,36.8 33.33,38.84 36.17,38.84 36.98,38.02 36.98,31.93 38.61,30.3 38.61,23.19 39.75,22.05 39.75,17.53 J2.27
N$28
  Top 0.178: IC8.12 27.55,35.5 26.82,34.77 26.82,31.72 27.84,30.71 29.26,30.71 32.11,33.55 32.11,36.4 33.73,38.02 35.76,38.02 36.17,37.62 36.17,31.52 37.8,29.9 37.8,22.78 38.61,21.97 38.61,18.97 J2.28
N$29  (via drill 0.38)
  Top 0.178: IC8.1 34.47,31.39 36.58,29.29 36.58,21.56 v35.76,20.75
  Bottom 0.178: v35.76,20.75 35.97,20.75 36.98,19.74 36.98,17.91 37.39,17.5 39.47,17.5 J2.29
N$30
  Top 0.178: IC8.5 33.24,35.5 32.51,34.77 32.51,32.74 36.17,29.08 36.17,22.17 34.75,20.75 34.75,19.33 34.54,19.13 34.54,15.47 35.15,14.86 38.81,14.86 39.62,15.67 39.62,16.69 40.64,17.7 40.64,18.47 J2.30
N$31  (via drill 0.38)
  Top 0.178: IC8.2 35.15,33.55 35.36,33.35 35.36,31.11 36.98,29.49 v36.98,20.75
  Bottom 0.178: v36.98,20.75 36.98,20.55 37.59,19.94 38.81,19.94 39.42,19.33 39.42,18.31 40.23,17.5 42.01,17.5 J2.31
N$32  (via drill 0.38)
  Top 0.178: IC8.4 35.07,34.85 35.76,34.16 35.76,31.32 37.39,29.69 37.39,21.97 v37.8,21.56
  Bottom 0.178: v37.8,21.56 37.8,20.95 38.2,20.55 41.5,20.55 J2.32
N$33
  Top 0.178: IC1.13 16.49,53.9 15.85,53.26 15.85,50.22 14.22,48.59 14.22,40.26 12.6,38.63 12.6,32.94 10.97,31.32 10.97,25.63 10.36,25.02 10.36,22.78 8.74,21.16 4.67,21.16 3.66,20.14 3.66,7.59 J1.1
N$34
  Top 0.178: IC1.14 16.65,53.25 16.26,52.86 16.26,50.01 14.63,48.39 14.63,40.06 13.01,38.43 13.01,32.74 11.38,31.11 11.38,25.43 10.77,24.82 10.77,22.58 8.94,20.75 4.88,20.75 4.06,19.94 4.06,9.73 J1.2
N$35
  Top 0.178: IC1.15 16.82,52.6 16.66,52.45 16.66,49.81 15.04,48.18 15.04,39.85 13.41,38.23 13.41,32.54 11.79,30.91 11.79,25.22 11.18,24.61 11.18,22.38 9.14,20.35 6.91,20.35 6.33,19.74 6.33,12.19 6.71,11.81 6.71,7.09 J1.3
N$36
  Top 0.178: IC1.12 18.22,54.55 18.49,54.28 18.49,51.03 15.44,47.98 15.44,39.65 13.82,38.02 13.82,32.33 12.19,30.71 12.19,25.02 11.58,24.41 11.58,22.17 9.35,19.94 7.32,19.94 6.71,19.33 6.71,12.42 7.92,11.2 7.92,8.61 J1.4
N$37
  Top 0.178: IC1.1 21.43,51.95 20.93,52.45 20.93,55.5 18.09,58.34 15.85,58.34 14.43,56.92 14.43,54.89 14.63,54.69 14.63,50.83 13.01,49.2 13.01,40.87 11.38,39.24 11.38,37.21 10.57,36.4 8.13,36.4 7.32,35.59 7.32,23.8 5.89,22.38 4.06,22.38 1.42,19.74 1.42,5.92 3.05,4.29 8.69,4.29 J1.5
N$38
  Top 0.178: IC1.5 21.88,54.55 21.34,55.09 21.34,55.7 18.29,58.75 15.65,58.75 14.02,57.12 14.02,54.69 14.22,54.48 14.22,51.03 12.6,49.4 12.6,41.07 10.36,38.84 8.74,38.84 6.91,37.01 6.91,24 5.69,22.78 3.86,22.78 1.02,19.94 1.02,5.71 2.85,3.89 10.36,3.89 11.58,5.11 11.58,7.29 J1.6
N$39  (via drill 0.38)
  Top 0.178: IC1.2 24.23,52.6 24.59,52.25 24.59,51.43 24.38,51.23 21.54,51.23 20.52,52.25 20.52,55.3 18.59,57.23 18.29,57.53 17.88,57.94 16.05,57.94 14.83,56.72 14.83,55.09 15.04,54.89 15.04,50.62 13.41,49 13.41,40.67 11.79,39.04 11.79,34.57 10.97,33.76 8.74,33.76 7.72,32.74 7.72,23.6 6.1,21.97 4.27,21.97 2.85,20.55 2.85,7.75 2.44,7.34 2.44,6.32 2.64,6.12 v2.64,5.92
  Bottom 0.178: v2.64,5.92 2.64,5.71 4.27,4.09 11.38,4.09 12.6,5.31 12.6,5.66 J1.7
N$40  (via drill 0.38)
  Top 0.178: IC1.4 24.15,53.9 24.99,53.06 24.99,51.23 24.59,50.83 21.34,50.83 20.12,52.04 20.12,55.09 17.68,57.53 16.26,57.53 15.24,56.51 15.24,55.3 15.44,55.09 15.44,50.42 13.82,48.79 13.82,40.46 12.19,38.84 12.19,33.15 10.36,31.32 8.74,31.32 8.13,30.71 8.13,23.39 6.3,21.56 4.47,21.56 3.25,20.35 v3.25,6.93
  Bottom 0.178: v3.25,6.93 3.25,6.73 3.66,6.32 3.66,5.31 4.47,4.5 11.18,4.5 11.79,5.11 11.79,7.39 J1.8
N$41  (via drill 0.38)
  Top 0.178: IC2.13 16.95,45.01 15.85,43.92 15.85,40.26 v16.26,39.9
  Bottom 0.178: v16.26,39.9 16.26,33.55 15.85,33.15 15.85,21.36 14.02,19.53 14.02,10.59 14.22,10.39 14.22,7.19 J1.9
N$42  (via drill 0.38)
  Top 0.178: IC2.14 16.91,44.36 16.26,43.71 16.26,40.87 v16.51,40.89
  Bottom 0.178: v16.51,40.89 17.07,40.26 17.07,39.45 16.66,39.04 16.66,33.35 16.26,32.94 16.26,21.16 14.4,19.33 14.43,11 15.44,9.98 J1.10
N$43  (via drill 0.38)
  Top 0.178: IC2.15 16.87,43.71 16.66,43.51 16.66,42.11 v16.92,41.88
  Bottom 0.178: v16.92,41.88 16.87,41.68 17.48,41.07 17.48,39.24 17.07,38.84 17.07,33.15 16.66,32.74 16.66,20.95 16.51,20.75 16.48,7.49 J1.11
N$44  (via drill 0.38)
  Top 0.178: IC2.12 18.17,45.66 18.49,45.34 18.49,40.67 v18.9,40.26
  Bottom 0.178: v18.9,40.26 18.9,30.51 19.71,29.69 19.71,28.47 18.29,27.05 18.29,20.75 16.87,19.33 16.87,9.63 J1.12
N$45  (via drill 0.38)
  Top 0.178: IC2.1 20.48,43.06 v20.12,42.7
  Bottom 0.178: v20.12,42.7 20.12,39.45 19.71,39.04 19.71,30.91 20.52,30.1 20.52,28.07 19.1,26.64 19.1,19.94 19.48,19.53 19.51,11.61 21.59,9.55 21.59,6.96 J1.13
N$46  (via drill 0.38)
  Top 0.178: IC2.5 22.07,45.66 v20.12,43.92
  Bottom 0.178: v20.12,43.92 19.3,43.1 19.3,41.48 19.71,41.07 19.71,39.85 19.3,39.45 19.3,30.71 20.12,29.9 20.12,28.27 18.69,26.85 18.69,19.74 19.1,19.33 19.1,9.93 J1.14
N$47  (via drill 0.38)
  Top 0.178: IC2.2 24.38,43.71 24.59,43.51 24.59,42.09 24.38,41.88 v21.13,41.88
  Bottom 0.178: v21.13,41.88 20.93,41.88 20.52,41.48 20.52,39.24 20.12,38.84 20.12,31.11 20.93,30.3 20.93,27.86 19.51,26.44 19.51,20.55 20.12,19.94 20.93,19.94 21.57,19.33 21.57,10.19 21.97,9.75 21.97,7.06 J1.15
N$48  (via drill 0.38)
  Top 0.178: v21.34,40.67 22.15,41.48 24.59,41.48 24.99,41.88 24.99,43.51 25.22,43.74 25.22,44.91 24.99,45.14 24.18,45.14 24.06,45.01 IC2.4
  Bottom 0.178: v21.34,40.67 21.34,39.45 20.52,38.63 20.52,31.32 21.34,30.51 21.34,27.66 19.91,26.24 19.91,20.75 20.32,20.35 21.13,20.35 21.95,19.53 21.95,10.59 22.96,9.58 22.96,8.61 J1.16
N$49
  Top 0.178: IC3.13 27.72,45.01 26.82,44.12 26.82,40.67 27.84,39.65 36.58,39.65 37.8,38.43 37.8,32.33 39.42,30.71 39.42,23.8 41.25,21.97 41.25,20.35 41.88,19.74 41.86,15.06 41.05,14.25 28.85,14.25 24.38,9.78 24.38,7.19 J1.17
N$50
  Top 0.178: IC3.14 27.68,44.36 27.23,43.92 27.23,40.87 28.04,40.06 36.78,40.06 38.2,38.63 38.2,32.54 39.83,30.91 39.83,24 41.66,22.17 41.66,20.55 42.27,19.94 42.27,14.86 41.25,13.84 29.06,13.84 25.6,10.39 J1.18
N$51
  Top 0.178: IC3.15 27.84,43.71 27.64,43.51 27.64,41.07 28.25,40.46 36.98,40.46 38.61,38.84 38.61,32.74 40.23,31.11 40.23,24.21 42.06,22.38 42.06,20.75 42.67,20.14 43.69,20.14 44.5,19.33 44.5,15.06 42.88,13.44 29.26,13.44 26.82,11 26.82,7.14 27.99,5.97 J1.19
N$52
  Top 0.178: IC3.12 29.14,45.66 29.26,45.54 29.26,41.48 29.87,40.87 37.19,40.87 39.01,39.04 39.01,32.94 40.64,31.32 40.64,24.41 42.47,22.58 42.47,20.95 42.88,20.55 43.89,20.55 44.88,19.53 44.91,14.86 43.08,13.03 29.67,13.03 28.04,11.4 28.04,8.61 J1.20
N$53
  Top 0.178: IC3.1 34.47,42.57 35.36,41.68 37.59,41.68 39.83,39.45 39.83,33.35 41.45,31.72 41.45,24.82 44.91,21.36 46.53,21.36 47.55,20.35 47.55,14.66 45.11,12.22 34.82,12.24 31.73,9.12 31.73,7.01 J1.21
N$54
  Top 0.178: IC3.5 33.85,45.66 32.51,44.32 32.51,42.09 33.33,41.27 37.39,41.27 39.42,39.24 39.42,33.15 41.05,31.52 41.05,24.61 44.7,20.95 46.33,20.95 47.14,20.14 47.14,14.86 44.91,12.62 34.7,12.62 31.39,9.37 J1.22
N$55
  Top 0.178: IC3.2 35.15,43.71 35.36,43.51 35.36,42.49 35.76,42.09 37.8,42.09 40.23,39.65 40.23,33.55 41.86,31.93 41.86,25.02 45.11,21.77 46.74,21.77 47.95,20.55 47.95,14.45 45.31,11.81 34.95,11.81 32.11,8.97 32.11,7.09 J1.23
N$56
  Top 0.178: J1.24 36.12,11.4 45.52,11.4 48.36,14.25 48.36,20.75 46.94,22.17 45.31,22.17 42.27,25.22 42.27,32.13 40.64,33.76 40.64,39.85 36.37,44.12 36.37,44.73 35.97,45.14 35.15,45.14 35.03,45.01 IC3.4
N$57  (via drill 0.38)
  Top 0.178: IC4.13 27.87,53.9 27.03,53.06 27.03,50.83 27.84,50.01 29.06,50.01 31.7,52.65 31.7,56.31 33.12,57.73 35.97,57.73 37.39,56.31 37.39,50.01 38.81,48.59 38.81,45.34 43.08,41.07 43.08,34.98 44.7,33.35 44.7,26.44 46.53,24.61 48.16,24.61 50.8,21.97 50.8,12.83 47.55,9.58 47.55,4.7 46.94,4.09 39.83,4.09 v39.22,4.29
  Bottom 0.178: v39.22,4.29 37.03,4.29 J1.25
N$58
  Top 0.178: IC4.14 29.25,53.25 30.89,54.89 30.89,56.72 32.72,58.55 36.37,58.55 38.2,56.72 38.2,50.42 39.62,49 39.62,45.75 43.89,41.48 43.89,35.38 45.52,33.76 45.52,26.85 46.94,25.43 48.56,25.43 51.61,22.38 51.61,12.42 48.36,9.17 48.36,4.09 47.55,3.28 40.23,3.28 40.03,3.07 37.8,3.07 37.19,3.68 37.19,7.09 J1.26
N$59
  Top 0.178: IC4.15 27.79,52.6 27.43,52.25 27.43,51.03 28.04,50.42 28.85,50.42 31.29,52.86 31.29,56.51 32.92,58.14 36.17,58.14 36.68,57.63 36.98,57.33 37.8,56.51 37.8,50.22 39.22,48.79 39.22,45.54 43.48,41.27 43.48,35.18 45.11,33.55 45.11,26.64 46.74,25.02 48.36,25.02 51.21,22.17 51.21,12.62 47.95,9.37 47.95,4.5 47.14,3.68 40.03,3.68 39.83,3.48 38.81,3.48 38.41,3.89 38.41,5.87 J1.27
N$60
  Top 0.178: IC4.12 27.91,54.55 26.62,53.26 26.62,50.62 27.64,49.61 29.26,49.61 32.11,52.45 32.11,56.11 33.33,57.33 35.76,57.33 36.98,56.11 36.98,49.81 38.41,48.39 38.41,45.14 42.67,40.87 42.67,34.77 44.3,33.15 44.3,26.24 46.33,24.21 47.95,24.21 50.39,21.77 50.39,13.03 47.14,9.78 47.14,4.9 46.74,4.5 40.44,4.5 39.62,5.31 39.62,7.19 J1.28
N$61
  Top 0.178: IC4.1 34.47,51.51 34.54,51.43 34.54,50.42 37.19,47.78 37.19,44.53 41.45,40.26 41.45,34.16 43.08,32.54 43.08,25.63 45.72,22.99 47.35,22.99 49.17,21.16 49.17,13.84 45.92,10.59 42.67,10.59 41.88,9.8 41.88,6.98 J1.29
N$62
  Top 0.178: IC4.5 33.4,54.55 32.51,53.67 32.51,51.84 36.78,47.57 36.78,44.32 41.05,40.06 41.05,33.96 42.67,32.33 42.67,25.43 45.52,22.58 47.14,22.58 48.77,20.95 48.77,14.05 45.72,11 42.06,11 40.84,9.78 J1.30
N$63
  Top 0.178: IC4.2 35.2,52.6 35.36,52.45 35.36,50.22 37.59,47.98 37.59,44.73 41.86,40.46 41.86,34.37 43.48,32.74 43.48,25.83 45.92,23.39 47.55,23.39 49.58,21.36 49.58,13.64 46.13,10.19 42.88,10.19 42.27,9.58 42.27,7.09 J1.31
N$64
  Top 0.178: IC4.4 35.39,53.9 35.56,54.08 36.17,54.08 36.58,53.67 36.58,49.61 38,48.18 38,44.93 42.27,40.67 42.27,34.57 43.89,32.94 43.89,26.03 46.13,23.8 47.75,23.8 49.99,21.56 49.99,13.44 46.33,9.78 44.65,9.78 J1.32
VDD_3V3EXP  (1 unrouted)
VDD_5V  (1 unrouted)

### Text on the board
tPlace: GND | C | 7 | 6 | 5 | 4 | 3 | 2 | 1 | 0 | Bypass: | IN | ch. 0-3 | ch. 4-7 | OUT | 0 | 1 | (c) Andrew / McPherson, / C4DM, QMUL | rev. A2 / 05/16 | 2 | 3 | 4 | 5 | Multiplexer / Capelet | 6 | 7 | +5V | GND | 4.1 / 4.0 | 4.3 / 4.2 | 4.5 / 4.4 | 4.7 / 4.6 | 5.1 / 5.0 | 6.1 / 6.0 | 7.1 / 7.0 | 7.3 / 7.2 | 7.5 / 7.4 | 7.7 / 7.6 | GND / COM | 0.1 / 0.0 | 0.3 / 0.2 | 0.5 / 0.4 | 0.7 / 0.6 | 1.1 / 1.0 | 1.3 / 1.2 | 1.5 / 1.4 | 1.7 / 1.6 | 2.1 / 2.0 | 2.3 / 2.2 | 2.5 / 2.4 | 2.7 / 2.6 | 3.1 / 3.0 | 3.3 / 3.2 | 3.5 / 3.4 | 3.7 / 3.6 | GND / COM